# EAGLE schematic GPIO_Audio_DLT (EAGLE 9.4.2)
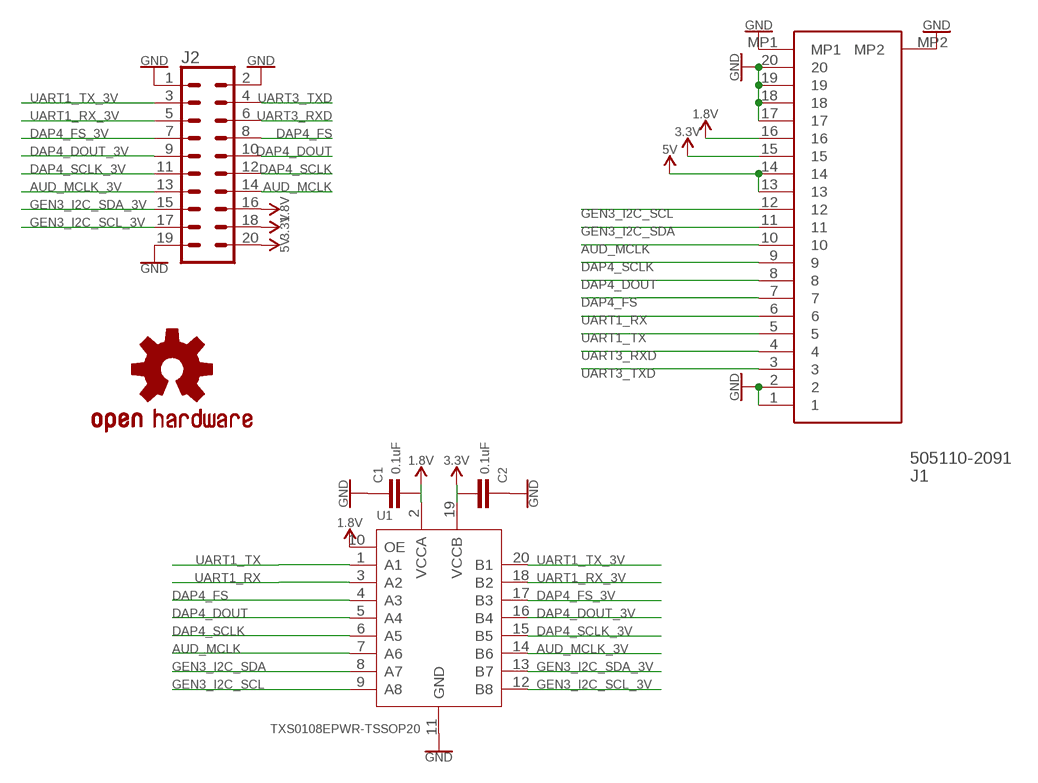
[diagram p0: schematic, sheet 1]

## Parts
C1  0.1uF  10NF-0603-50V-10%  [0603]
C2  0.1uF  10NF-0603-50V-10%  [0603]
J1  505110-2091  [5051102091]
J2  CONN_10X2  [2X10]
LOGO1  OSHW-LOGOS-COPPER  [OSHW-LOGO-S_COPPER]
U1  TXS0108EPWR-TSSOP20  LOGIC-TXS0108EPWR(TSSOP20)  [TSSOP20-0.65-6.5X4.4MM]

## Nets
1.8V: C1.2 J1.16 J2.16 U1.2(VCCA) U1.10(OE)
3.3V: C2.1 J1.15 J2.18 U1.19(VCCB)
5V: J1.13 J1.14 J2.20
AUD_MCLK: J1.10 J2.14 U1.7(A6)
AUD_MCLK_3V: J2.13 U1.14(B6)
DAP4_DOUT: J1.8 J2.10 U1.5(A4)
DAP4_DOUT_3V: J2.9 U1.16(B4)
DAP4_FS: J1.7 J2.8 U1.4(A3)
DAP4_FS_3V: J2.7 U1.17(B3)
DAP4_SCLK: J1.9 J2.12 U1.6(A5)
DAP4_SCLK_3V: J2.11 U1.15(B5)
GEN3_I2C_SCL: J1.12 U1.9(A8)
GEN3_I2C_SCL_3V: J2.17 U1.12(B8)
GEN3_I2C_SDA: J1.11 U1.8(A7)
GEN3_I2C_SDA_3V: J2.15 U1.13(B7)
GND: C1.1 C2.2 J1.1 J1.2 J1.17 J1.18 J1.19 J1.20 J1.MP1 J1.MP2 J2.1 J2.2 J2.19 U1.11(GND)
UART1_RX: J1.6 U1.3(A2)
UART1_RX_3V: J2.5 U1.18(B2)
UART1_TX: J1.5 U1.1(A1)
UART1_TX_3V: J2.3 U1.20(B1)
UART3_RXD: J1.4 J2.6
UART3_TXD: J1.3 J2.4

## Library data of the parts
C1 C2 = SparkFun-Capacitors:10NF: 0.01uF/10nF/10,000pF ceramic capacitors A capacitor is a passive two-terminal electrical component used to store electrical energy temporarily in an electric field. CAP-09321; PROD_ID: CAP-00867; VALUE: 10nF
J1 = SamacSys_Parts:505110-2091: MOLEX - 505110-2091 - CONNECTOR, FFC/FPC, 20POS, 1ROW, 0.5MM Source: Datasheet <https://componentsearchengine.com/Datasheets/1/505110-2091.pdf>; DESCRIPTION: MOLEX - 505110-2091 - CONNECTOR, FFC/FPC, 20POS, 1ROW, 0.5MM; HEIGHT: 2.1mm; MANUFACTURER_NAME: Molex; MANUFACTURER_PART_NUMBER: 505110-2091; MOUSER_PART_NUMBER: 538-505110-2091; MOUSER_PRICE-STOCK: https://www.mouser.com/Search/Refine.aspx?Keyword=538-505110-2091
J2 = SparkFun-Connectors:CONN_10X2: Multi connection point. Often used as Generic Header-pin footprint for 0.1 inch spaced/style header connections On any of the 0.1 inch spaced packages, you can populate with these: Break Away Headers - Straight <https://www.sparkfun.com/products/116> (PRT-00116) Break Away Male Headers - Right Angle <https://www.sparkfun.com/products/553> (PRT-00553) Female Headers <https://www.sparkfun.com/products/115> (PRT-00115) Break Away Headers - Machine Pin <https://www.sparkfun.com/products/117> (PRT-00117) Break Away Female Headers - Swiss Machine Pin <https://www.sparkfun.com/products/743> (PRT-00743) Special note about the "SPECIAL" package: This was SPECIALLY designed to be used with our Graphic LCD Backpack. Be sure you want to use this! It is not only staggered on each line of header holes, but IT IS ALSO offset of the center point of the top and bottom lines by 5 mil. This causes the headers to lock into place on the "standard" footprint on the LCD screen. The extra squares on the tdocu layer are there simply to reference other pins (if you were to actually populate a longer header than ten long - this is what we do with the backpacks).
LOGO1 = SparkFun-Aesthetics:OSHW-LOGO: Open-Source Hardware (OSHW) Logo This logo indicates the piece of hardware it is found on incorporates a OSHW license and/or adheres to the definition of open source hardware found here: http://freedomdefined.org/OSHW
U1 = OPL_IC:LOGIC-TXS0108EPWR(TSSOP20): 310050026; MPN: TXS0108EPWR